# EAGLE design 16x32 Matrix (EAGLE 5.11)
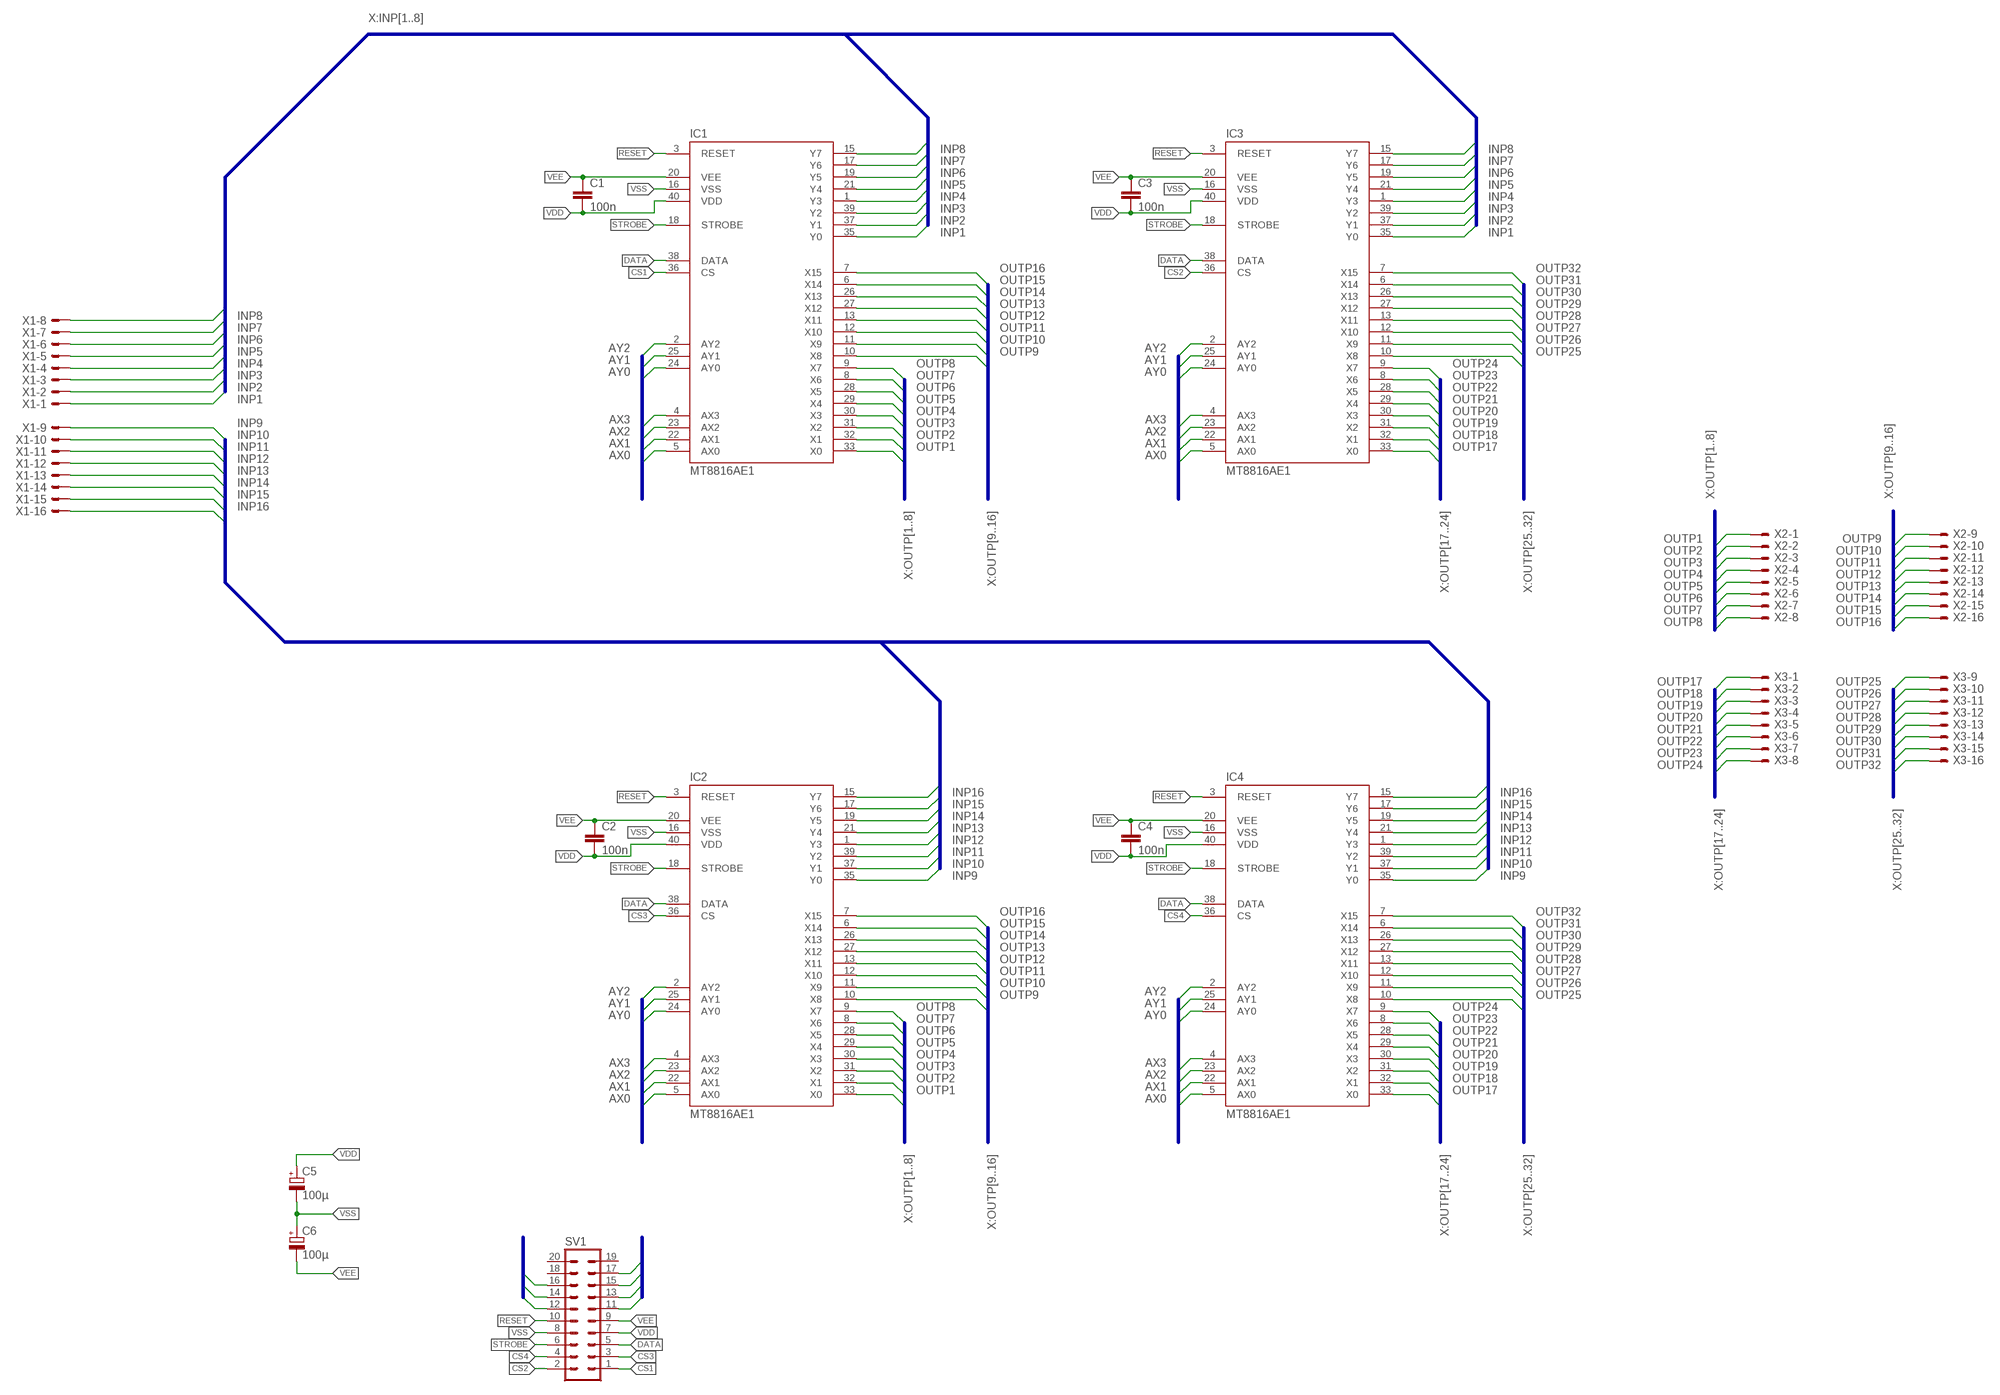
[diagram p0: schematic, sheet 1]

## Parts
C1  100n  C-EU050-035X075  [C050-035X075]
C2  100n  C-EU050-035X075  [C050-035X075]
C3  100n  C-EU050-035X075  [C050-035X075]
C4  100n  C-EU050-035X075  [C050-035X075]
C5  100µ  CPOL-EUE5-8.5  [E5-8,5]
C6  100µ  CPOL-EUE5-8.5  [E5-8,5]
IC1  MT8816AE1  [DIL40]
IC2  MT8816AE1  [DIL40]
IC3  MT8816AE1  [DIL40]
IC4  MT8816AE1  [DIL40]
SV1  ML203M  [3M_20]
X1  ML163ME  [3M_16]
X2  ML163ME  [3M_16]
X3  ML163ME  [3M_16]

## Nets
AX0: IC1.5(AX0) IC2.5(AX0) IC3.5(AX0) IC4.5(AX0) SV1.11
AX1: IC1.22(AX1) IC2.22(AX1) IC3.22(AX1) IC4.22(AX1) SV1.12
AX2: IC1.23(AX2) IC2.23(AX2) IC3.23(AX2) IC4.23(AX2) SV1.13
AX3: IC1.4(AX3) IC2.4(AX3) IC3.4(AX3) IC4.4(AX3) SV1.14
AY0: IC1.24(AY0) IC2.24(AY0) IC3.24(AY0) IC4.24(AY0) SV1.15
AY1: IC1.25(AY1) IC2.25(AY1) IC3.25(AY1) IC4.25(AY1) SV1.16
AY2: IC1.2(AY2) IC2.2(AY2) IC3.2(AY2) IC4.2(AY2) SV1.17
CS1: IC1.36(CS) SV1.1
CS2: IC3.36(CS) SV1.2
CS3: IC2.36(CS) SV1.3
CS4: IC4.36(CS) SV1.4
DATA: IC1.38(DATA) IC2.38(DATA) IC3.38(DATA) IC4.38(DATA) SV1.5
INP1: IC1.35(Y0) IC3.35(Y0) X1.1
INP2: IC1.37(Y1) IC3.37(Y1) X1.2
INP3: IC1.39(Y2) IC3.39(Y2) X1.3
INP4: IC1.1(Y3) IC3.1(Y3) X1.4
INP5: IC1.21(Y4) IC3.21(Y4) X1.5
INP6: IC1.19(Y5) IC3.19(Y5) X1.6
INP7: IC1.17(Y6) IC3.17(Y6) X1.7
INP8: IC1.15(Y7) IC3.15(Y7) X1.8
INP9: IC2.35(Y0) IC4.35(Y0) X1.9
INP10: IC2.37(Y1) IC4.37(Y1) X1.10
INP11: IC2.39(Y2) IC4.39(Y2) X1.11
INP12: IC2.1(Y3) IC4.1(Y3) X1.12
INP13: IC2.21(Y4) IC4.21(Y4) X1.13
INP14: IC2.19(Y5) IC4.19(Y5) X1.14
INP15: IC2.17(Y6) IC4.17(Y6) X1.15
INP16: IC2.15(Y7) IC4.15(Y7) X1.16
OUTP1: IC1.33(X0) IC2.33(X0) X2.1
OUTP2: IC1.32(X1) IC2.32(X1) X2.2
OUTP3: IC1.31(X2) IC2.31(X2) X2.3
OUTP4: IC1.30(X3) IC2.30(X3) X2.4
OUTP5: IC1.29(X4) IC2.29(X4) X2.5
OUTP6: IC1.28(X5) IC2.28(X5) X2.6
OUTP7: IC1.8(X6) IC2.8(X6) X2.7
OUTP8: IC1.9(X7) IC2.9(X7) X2.8
OUTP9: IC1.10(X8) IC2.10(X8) X2.9
OUTP10: IC1.11(X9) IC2.11(X9) X2.10
OUTP11: IC1.12(X10) IC2.12(X10) X2.11
OUTP12: IC1.13(X11) IC2.13(X11) X2.12
OUTP13: IC1.27(X12) IC2.27(X12) X2.13
OUTP14: IC1.26(X13) IC2.26(X13) X2.14
OUTP15: IC1.6(X14) IC2.6(X14) X2.15
OUTP16: IC1.7(X15) IC2.7(X15) X2.16
OUTP17: IC3.33(X0) IC4.33(X0) X3.1
OUTP18: IC3.32(X1) IC4.32(X1) X3.2
OUTP19: IC3.31(X2) IC4.31(X2) X3.3
OUTP20: IC3.30(X3) IC4.30(X3) X3.4
OUTP21: IC3.29(X4) IC4.29(X4) X3.5
OUTP22: IC3.28(X5) IC4.28(X5) X3.6
OUTP23: IC3.8(X6) IC4.8(X6) X3.7
OUTP24: IC3.9(X7) IC4.9(X7) X3.8
OUTP25: IC3.10(X8) IC4.10(X8) X3.9
OUTP26: IC3.11(X9) IC4.11(X9) X3.10
OUTP27: IC3.12(X10) IC4.12(X10) X3.11
OUTP28: IC3.13(X11) IC4.13(X11) X3.12
OUTP29: IC3.27(X12) IC4.27(X12) X3.13
OUTP30: IC3.26(X13) IC4.26(X13) X3.14
OUTP31: IC3.6(X14) IC4.6(X14) X3.15
OUTP32: IC3.7(X15) IC4.7(X15) X3.16
RESET: IC1.3(RESET) IC2.3(RESET) IC3.3(RESET) IC4.3(RESET) SV1.10
STROBE: IC1.18(STROBE) IC2.18(STROBE) IC3.18(STROBE) IC4.18(STROBE) SV1.6
VDD: C1.2 C2.2 C3.2 C4.2 C5.+ IC1.40(VDD) IC2.40(VDD) IC3.40(VDD) IC4.40(VDD) SV1.7
VEE: C1.1 C2.1 C3.1 C4.1 C6.- IC1.20(VEE) IC2.20(VEE) IC3.20(VEE) IC4.20(VEE) SV1.9
VSS: C5.- C6.+ IC1.16(VSS) IC2.16(VSS) IC3.16(VSS) IC4.16(VSS) SV1.8
Unconnected: SV1.18 SV1.19 SV1.20

## Buses
X:INP[1..8]
X:INP[9..16]
X:OUTP[1..8]
X:OUTP[25..32]
X:OUTP[9..16]
ADDRESS:AY[0..2],AX[0..3]
X:OUTP[17..24]

## Library data of the parts
C1-C4 = resistor:C-EU: CAPACITOR, European symbol
C5 C6 = resistor:CPOL-EU: POLARIZED CAPACITOR, European symbol
IC1-IC4 = MT8816:MT8816: 8x16 Analog Switch Array
SV1 = con-harting-ml:ML20: HARTING; OC_FARNELL: unknown; OC_NEWARK: unknown
X1-X3 = con-harting-ml:ML16?E: HARTING; OC_FARNELL: unknown; OC_NEWARK: unknown

## Board
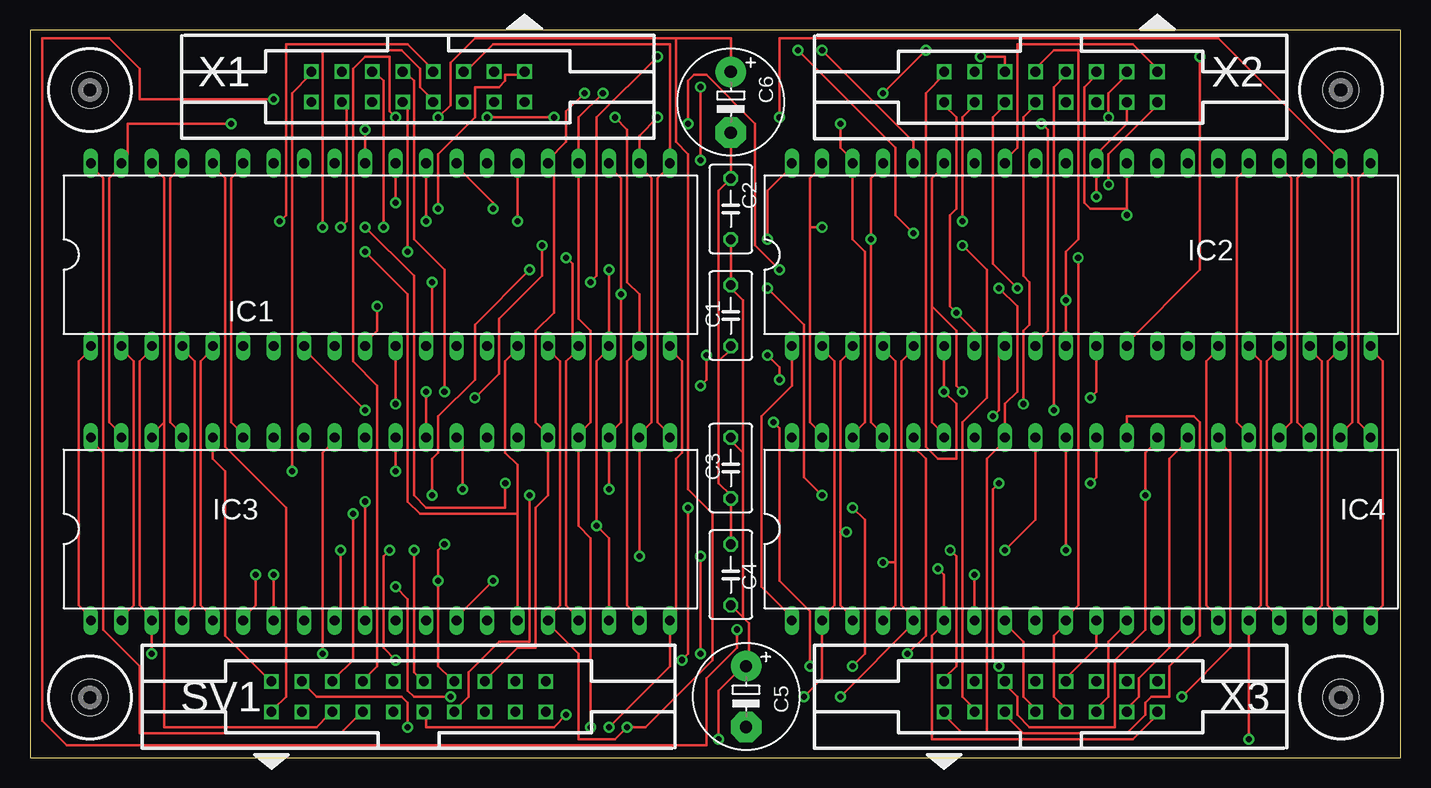
[diagram p1: board, top side]
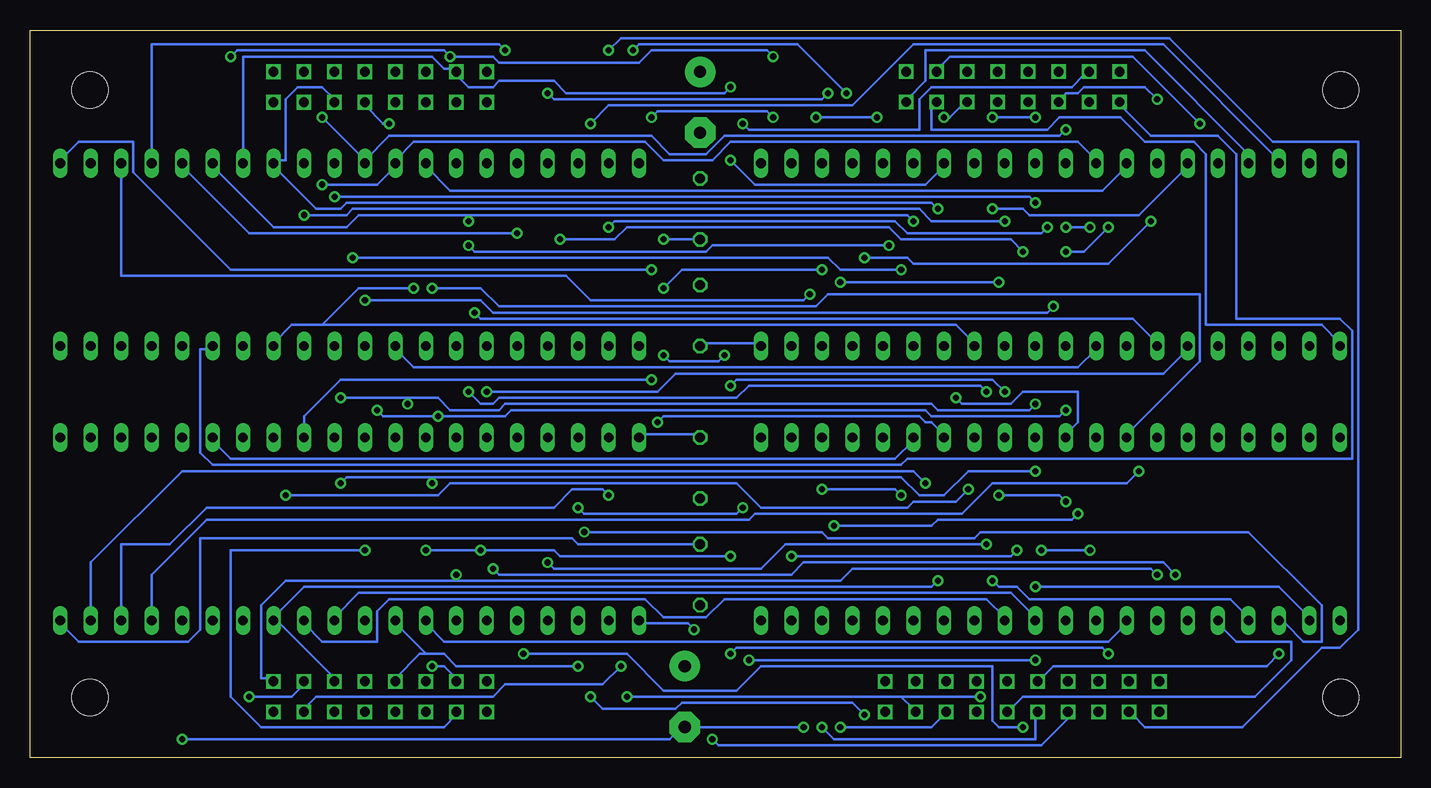
[diagram p2: board, bottom side, seen from below]

Size 114.28 x 60.63 mm. Coordinates in mm from the lower left corner, seen from the top.
Outline: 0,0 114.28,0 114.28,60.63 0,60.63 0,0
Copper layers (1*16): Top 0.035mm / dielectric 1.5mm / Bottom 0.035mm
Design rules "qp_designrules_8mil": minimum track width 8mil, minimum drill 20mil, track to track 8mil, track to pad 8mil, pad to pad 8mil, via to via 8mil, smd to smd 8mil, copper to edge 20mil, drill to drill 20mil, minimum pad ring 8mil, minimum via ring 8mil, stop-mask expansion 0mil, vias tented up to drill 0mil, thermal gap 10mil

### Footprints (pad centres in the part's own frame; a part is rotated, then mirrored left to right if it is on the bottom)
C050-035X075 = drill 0.813 octagon: 1 -2.54,0; 2 2.54,0
E5-8,5 = drill 1.016 pad 2.54 round: + -2.54,0 | drill 1.016 pad 2.54 octagon: - 2.54,0
DIL40 = drill 0.813 long: 1 -24.13,-7.62; 2 -21.59,-7.62; 3 -19.05,-7.62; 4 -16.51,-7.62; 5 -13.97,-7.62; 6 -11.43,-7.62; 7 -8.89,-7.62; 8 -6.35,-7.62; 9 -3.81,-7.62; 10 -1.27,-7.62; 11 1.27,-7.62; 12 3.81,-7.62; 13 6.35,-7.62; 14 8.89,-7.62; 15 11.43,-7.62; 16 13.97,-7.62; 17 16.51,-7.62; 18 19.05,-7.62; 19 21.59,-7.62; 20 24.13,-7.62; 21 24.13,7.62; 22 21.59,7.62; 23 19.05,7.62; 24 16.51,7.62; 25 13.97,7.62; 26 11.43,7.62; 27 8.89,7.62; 28 6.35,7.62; 29 3.81,7.62; 30 1.27,7.62; 31 -1.27,7.62; 32 -3.81,7.62; 33 -6.35,7.62; 34 -8.89,7.62; 35 -11.43,7.62; 36 -13.97,7.62; 37 -16.51,7.62; 38 -19.05,7.62; 39 -21.59,7.62; 40 -24.13,7.62
3M_20 = drill 0.813 square: 1 -11.43,-1.27; 2 -11.43,1.27; 3 -8.89,-1.27; 4 -8.89,1.27; 5 -6.35,-1.27; 6 -6.35,1.27; 7 -3.81,-1.27; 8 -3.81,1.27; 9 -1.27,-1.27; 10 -1.27,1.27; 11 1.27,-1.27; 12 1.27,1.27; 13 3.81,-1.27; 14 3.81,1.27; 15 6.35,-1.27; 16 6.35,1.27; 17 8.89,-1.27; 18 8.89,1.27; 19 11.43,-1.27; 20 11.43,1.27
DRIL-3 = hole 3: 0,0
3M_16 = drill 0.813 square: 1 -8.89,-1.27; 2 -8.89,1.27; 3 -6.35,-1.27; 4 -6.35,1.27; 5 -3.81,-1.27; 6 -3.81,1.27; 7 -1.27,-1.27; 8 -1.27,1.27; 9 1.27,-1.27; 10 1.27,1.27; 11 3.81,-1.27; 12 3.81,1.27; 13 6.35,-1.27; 14 6.35,1.27; 15 8.89,-1.27; 16 8.89,1.27

### Placement (x,y rotation side)
C1  58.42,36.83 90 top
C2  58.42,45.72 270 top
C3  58.42,24.13 90 top
C4  58.42,15.24 270 top
C5  59.69,5.08 270 top
C6  58.42,54.61 270 top
IC1  29.21,41.91 0 top
IC2  87.63,41.91 0 top
IC3  29.21,19.05 0 top
IC4  87.63,19.05 0 top
SV1  31.56,5.08 0 top
U$1  [DRIL-3]  5,5 0 top
U$2  [DRIL-3]  109.28,5 0 top
U$3  [DRIL-3]  5,55.63 0 top
U$4  [DRIL-3]  109.28,55.63 0 top
X1  32.34,55.89 180 top
X2  85.09,55.88 180 top
X3  85.09,5.08 0 top

### Tracks (layer width: path | path; a pad name or v marks a point on that pad's centre or on a via)
AX0  (via drill 0.51)
  Top 0.203: IC2.5 73.66,34.04 72.64,33.02 72.64,12.7 73.66,11.68 IC4.5 73.66,11.18 v67.56,5.08 | IC3.5 15.24,11.68 14.22,12.7 14.22,33.02 15.24,34.04 IC1.5 | v44.7,3.56 43.69,2.54 33.02,2.54 33.02,3.56 SV1.11
  Bottom 0.203: SV1.11 32.51,4.06 31.5,5.08 12.19,5.08 9.14,8.13 9.14,9.65 13.72,9.65 15.24,11.18 IC3.5 | v67.56,5.08 66.55,4.06 60.45,4.06 59.94,4.57 45.72,4.57 v44.7,3.56
AX1  (via drill 0.51)
  Top 0.203: IC4.22 109.22,26.92 110.24,27.94 110.24,48.26 109.22,49.28 IC2.22 109.22,49.78 99.06,59.94 62.48,59.94 v62.48,53.34 | v32,17.27 32,7.11 32.51,6.6 SV1.12 | v50.8,16.76 IC3.22 50.8,26.92 51.82,27.94 51.82,48.26 50.8,49.28 IC1.22 50.8,51.82 v52.32,53.34
  Bottom 0.203: v32,17.27 32.51,16.76 v50.8,16.76 | v62.48,53.34 61.98,53.85 52.83,53.85 v52.32,53.34
AX2  (via drill 0.51)
  Top 0.203: IC4.23 106.68,26.92 105.66,27.94 105.66,48.26 106.68,49.28 IC2.23 | v41.66,21.84 41.66,9.65 39.12,9.65 36.58,7.11 36.58,5.08 35.56,4.06 SV1.13 | v48.26,22.35 IC3.23 48.26,26.92 49.28,27.94 v49.28,38.61 49.28,48.26 48.26,49.28 IC1.23
  Bottom 0.203: v41.66,21.84 42.16,22.35 v48.26,22.35 | v49.28,38.61 49.78,38.1 67.56,38.1 69.6,40.13 106.68,40.13 IC2.23
AX3  (via drill 0.51)
  Top 0.203: 72.14,16.26 72.14,33.02 71.12,34.04 IC2.4 | 72.14,16.26 72.14,12.7 71.12,11.68 IC4.4 | IC3.4 12.7,11.68 13.72,12.7 13.72,33.02 12.7,34.04 IC1.4 | SV1.14 35.05,6.6 34.04,7.62 v34.04,14.73 34.04,17.27 v34.54,17.78 | v71.12,16.26 72.14,16.26
  Bottom 0.203: v34.04,14.73 33.53,14.22 32,14.22 30.99,13.21 14.22,13.21 12.7,11.68 IC3.4 | v71.12,16.26 70.61,15.75 53.34,15.75 51.31,17.78 v34.54,17.78
AY0  (via drill 0.51)
  Top 0.203: IC4.24 104.14,26.92 105.16,27.94 105.16,48.26 104.14,49.28 IC2.24 | v46.74,2.54 46.74,18.29 45.72,19.3 IC3.24 45.72,26.92 46.74,27.94 46.74,35.56 45.72,36.58 IC1.24 45.72,53.34 v47.75,55.37 | v71.12,55.37 v74.68,58.93
  Bottom 0.203: v46.74,2.54 39.12,2.54 38.1,3.56 SV1.15 | v74.68,58.93 75.18,59.44 104.14,59.44 IC2.24 | v71.12,55.37 70.61,54.86 48.26,54.86 v47.75,55.37
AY1  (via drill 0.51)
  Top 0.203: IC4.25 101.6,26.92 100.58,27.94 100.58,48.26 101.6,49.28 IC2.25 | SV1.16 38.1,6.6 40.64,9.14 42.16,9.14 42.16,20.83 43.18,21.84 IC3.25 43.18,26.92 42.16,27.94 42.16,35.56 43.69,37.08 43.69,48.77 43.18,49.28 IC1.25 43.18,49.78 44.7,51.31 44.7,53.85 v46.23,55.37 | v73.66,43.69 72.14,45.21 72.14,50.8 v64.01,58.93
  Bottom 0.203: v73.66,43.69 96.01,43.69 101.6,49.28 IC2.25 | v64.01,58.93 63.5,59.44 50.29,59.44 v46.23,55.37
AY2  (via drill 0.51)
  Top 0.203: IC3.2 7.62,11.68 8.64,12.7 8.64,33.02 7.62,34.04 IC1.2 | v64.52,5.08 66.04,6.6 IC4.2 66.04,11.68 67.06,12.7 67.06,33.02 66.04,34.04 IC2.2 | v30.48,14.22 31.5,13.21 31.5,5.59 32,5.08 v35.05,5.08
  Bottom 0.203: 41.66,5.08 40.64,4.06 SV1.17 | 41.66,5.08 v64.52,5.08 | v30.48,14.22 10.16,14.22 7.62,11.68 IC3.2 | v35.05,5.08 41.66,5.08
CS1
  Top 0.203: SV1.1 20.32,4.06 21.34,5.08 21.34,20.83 16.26,25.91 16.26,48.26 15.24,49.28 IC1.36
CS2
  Top 0.203: SV1.2 19.81,6.6 16.26,10.16 16.26,23.88 15.24,24.89 IC3.36
CS3  (via drill 0.51)
  Top 0.203: v66.04,58.93 73.66,51.31 IC2.36
  Bottom 0.203: v66.04,58.93 65.02,59.94 19.3,59.94 10.67,51.31 3.56,51.31 3.56,10.67 5.08,9.14 6.6,9.14 13.21,2.54 21.34,2.54 22.35,3.56 SV1.3
CS4  (via drill 0.51)
  Top 0.203: v31.5,2.54 31.5,4.57 30.99,5.08 23.88,5.08 22.86,6.1 SV1.4 | v73.15,8.64 74.68,10.16 74.68,24.89 73.66,25.91 IC4.36
  Bottom 0.203: v31.5,2.54 33.53,2.54 34.04,3.05 34.04,7.62 53.34,7.62 55.37,5.59 61.47,5.59 64.52,8.64 v73.15,8.64
DATA  (via drill 0.51)
  Top 0.203: IC4.38 68.58,26.92 69.6,27.94 69.6,42.16 68.58,43.18 IC2.38 68.58,49.78 67.56,50.8 v67.56,52.83 | 11.18,27.94 10.16,26.92 IC3.38 | 11.18,27.94 11.18,48.26 10.16,49.28 IC1.38 | 11.18,27.94 11.18,2.54 23.88,2.54 24.89,3.56 SV1.5
  Bottom 0.203: v67.56,52.83 66.04,54.36 45.72,54.36 40.64,59.44 19.81,59.44 10.16,49.78 IC1.38
INP1  (via drill 0.51)
  Top 0.203: IC3.35 17.78,26.92 16.76,27.94 16.76,48.26 17.78,49.28 IC1.35 | v34.04,45.72 34.04,50.29 37.08,53.34 37.08,55.88 39.12,55.88 39.62,56.39 39.62,56.9 41.15,56.9 X1.1
  Bottom 0.203: v34.04,45.72 31.5,45.72 30.99,45.21 21.84,45.21 17.78,49.28 IC1.35
INP2
  Top 0.203: IC3.37 12.7,26.92 11.68,27.94 11.68,48.26 12.7,49.28 IC1.37
  Bottom 0.203: X1.2 41.15,54.86 39.62,56.39 39.62,58.93 21.34,58.93 12.7,50.29 IC1.37
INP3  (via drill 0.51)
  Top 0.203: IC3.39 7.62,26.92 6.6,27.94 6.6,48.26 7.62,49.28 IC1.39 7.62,49.78 8.13,50.29 8.13,52.83 v16.76,52.83
  Bottom 0.203: v16.76,52.83 22.35,58.42 37.59,58.42 38.61,57.4 X1.3
INP4
  Top 0.203: IC3.1 5.08,11.68 4.06,12.7 4.06,33.02 5.08,34.04 IC1.1
  Bottom 0.203: X1.4 39.12,54.36 39.12,52.32 29.46,52.32 28.45,53.34 23.37,53.34 21.34,51.31 17.27,51.31 16.26,50.29 16.26,36.07 6.6,36.07 5.08,34.54 IC1.1
INP5
  Top 0.203: IC3.21 53.34,26.92 52.32,27.94 52.32,48.26 53.34,49.28 IC1.21 53.34,59.44 38.61,59.44 36.58,57.4 X1.5
INP6  (via drill 0.51)
  Top 0.203: IC3.19 50.8,11.68 49.78,12.7 49.78,33.02 50.8,34.04 IC1.19 50.8,38.61 49.78,39.62 49.78,52.32 v48.77,53.34 | v43.69,53.34 v38.1,53.34
  Bottom 0.203: v38.1,53.34 37.59,53.34 36.58,54.36 X1.6 | v48.77,53.34 v43.69,53.34
INP7  (via drill 0.51)
  Top 0.203: 45.21,33.53 45.72,34.04 IC1.17 45.21,33.53 | 45.21,33.53 44.7,33.02 44.7,12.7 45.72,11.68 IC3.17 | v20.83,44.7 21.34,45.21 21.34,59.44 31.5,59.44 33.53,57.4 X1.7 | v44.7,41.66 45.21,41.15 45.21,33.53
  Bottom 0.203: v20.83,44.7 24.38,41.15 40.64,41.15 41.15,41.66 v44.7,41.66
INP8  (via drill 0.51)
  Top 0.203: 40.64,20.32 40.64,24.38 39.62,25.4 39.62,33.02 40.64,34.04 IC1.15 | IC3.15 40.64,20.32 | v24.38,44.2 24.38,58.93 30.99,58.93 32.51,57.4 32.51,55.88 33.53,54.86 X1.8 | v27.94,42.16 31.5,38.61 31.5,21.34 32.51,20.32 40.64,20.32
  Bottom 0.203: v24.38,44.2 26.42,42.16 v27.94,42.16
INP9  (via drill 0.51)
  Top 0.203: 75.18,37.59 75.18,48.26 76.2,49.28 IC2.35 | 75.18,37.59 75.18,27.94 76.2,26.92 IC4.35 | v34.54,30.48 34.54,40.64 32,43.18 32,56.39 31.5,56.9 X1.9 | v77.72,30.48 77.22,30.99 77.22,35.56 75.18,37.59
  Bottom 0.203: v34.54,30.48 35.05,30.99 54.36,30.99 55.37,29.97 75.18,29.97 75.69,29.46 76.71,29.46 v77.72,30.48
INP10  (via drill 0.51)
  Top 0.203: IC4.37 71.12,26.92 70.1,27.94 v70.1,43.18 70.1,48.26 71.12,49.28 IC2.37 | v31.5,42.16 31.5,54.36 X1.10
  Bottom 0.203: v31.5,42.16 32.51,43.18 41.66,43.18 42.67,44.2 64.52,44.2 65.53,43.18 v70.1,43.18
INP11  (via drill 0.51)
  Top 0.203: 65.02,44.2 65.02,48.26 66.04,49.28 IC2.39 | 65.02,44.2 65.02,27.94 66.04,26.92 IC4.39 | v29.46,44.2 29.46,56.39 28.96,56.9 X1.11 | v66.04,44.2 65.02,44.2
  Bottom 0.203: v29.46,44.2 29.97,43.69 41.15,43.69 42.16,44.7 65.53,44.7 v66.04,44.2
INP12  (via drill 0.51)
  Top 0.203: IC4.1 63.5,11.68 60.96,14.22 60.96,28.45 63.5,30.99 IC2.1 | v20.32,54.86 9.14,54.86 9.14,57.4 6.6,59.94 1.02,59.94 1.02,3.05 3.05,1.02 56.39,1.02 56.39,6.6 58.93,9.14 v58.93,10.67
  Bottom 0.203: v20.32,54.86 21.34,55.88 26.42,55.88 26.92,55.37 27.94,55.37 28.45,54.86 X1.12 | v58.93,10.67 59.44,11.18 63.5,11.18 IC4.1
INP13  (via drill 0.51)
  Top 0.203: IC4.21 111.76,26.92 110.74,27.94 110.74,48.26 111.76,49.28 IC2.21 | v54.86,52.83 54.86,56.39 55.37,56.9 56.39,56.9 60.45,52.83 60.45,42.67 v62.48,40.64
  Bottom 0.203: v54.86,52.83 54.36,52.32 40.13,52.32 40.13,54.86 39.12,55.88 27.43,55.88 26.42,56.9 X1.13 | v62.48,40.64 97.54,40.64 105.66,48.77 105.66,51.31 110.24,51.31 111.76,49.78 IC2.21
INP14  (via drill 0.51)
  Top 0.203: IC4.19 109.22,11.68 108.2,12.7 108.2,33.02 109.22,34.04 IC2.19 | v25.91,44.2 26.42,44.7 26.42,54.36 X1.14 | v27.94,44.2 32,40.13 32,21.84 33.02,20.83 39.62,20.83 v39.62,22.86
  Bottom 0.203: v27.94,44.2 v25.91,44.2 | v39.62,22.86 40.64,23.88 101.6,23.88 109.22,16.26 IC4.19
INP15  (via drill 0.51)
  Top 0.203: IC4.17 104.14,11.68 103.12,12.7 103.12,33.02 104.14,34.04 IC2.17 | v21.84,23.88 21.84,55.37 23.37,56.9 X1.15
  Bottom 0.203: v21.84,23.88 22.86,22.86 34.04,22.86 36.58,20.32 53.85,20.32 54.36,19.81 99.57,19.81 104.14,15.24 IC4.17
INP16
  Top 0.203: IC4.15 99.06,11.68 98.04,12.7 98.04,33.02 99.06,34.04 IC2.15
  Bottom 0.203: X1.16 23.37,54.36 20.83,51.82 15.24,51.82 13.72,50.29 13.72,36.58 5.08,36.58 4.06,35.56 4.06,24.89 41.15,24.89 41.66,24.38 99.06,24.38 100.08,25.4 100.08,34.04 99.06,34.04 IC2.15
OUTP1
  Top 0.203: X2.1 93.98,57.4 91.95,59.44 82.3,59.44 82.3,50.8 81.28,49.78 IC2.33
  Bottom 0.203: IC1.33 22.86,49.28 24.89,47.24 79.25,47.24 81.28,49.28 IC2.33
OUTP2  (via drill 0.51)
  Top 0.203: v89.92,47.75 89.92,50.29 93.98,54.36 X2.2
  Bottom 0.203: IC1.32 25.4,49.78 26.92,51.31 55.88,51.31 57.4,49.78 61.47,49.78 62.99,51.31 82.3,51.31 83.82,49.78 IC2.32 83.82,49.28 85.34,47.75 v89.92,47.75
OUTP3  (via drill 0.51)
  Top 0.203: IC1.31 v27.94,52.32 | v89.92,53.34 89.92,55.37 91.44,56.9 X2.3
  Bottom 0.203: v27.94,52.32 28.45,51.82 56.39,51.82 57.91,50.29 60.96,50.29 62.48,51.82 84.33,51.82 86.36,49.78 | 86.36,49.78 v89.92,53.34 | 86.36,49.78 IC2.31
OUTP4  (via drill 0.51)
  Top 0.203: v30.48,46.23 IC1.30 | v88.9,46.74 IC2.30 88.9,50.29 91.44,52.83 X2.4
  Bottom 0.203: v30.48,46.23 30.99,46.74 v88.9,46.74
OUTP5  (via drill 0.51)
  Top 0.203: v91.44,45.21 91.44,45.72 | v33.02,44.7 IC1.29 | 91.44,45.72 IC2.29 | 91.44,45.72 88.39,45.72 87.88,46.23 87.88,55.88 88.9,56.9 X2.5
  Bottom 0.203: v33.02,44.7 39.12,44.7 40.13,45.72 87.38,45.72 87.88,45.21 v91.44,45.21
OUTP6  (via drill 0.51)
  Top 0.203: v38.61,45.72 38.61,46.23 35.56,49.28 IC1.28
  Bottom 0.203: v38.61,45.72 39.12,46.23 87.88,46.23 88.39,45.72 90.42,45.72 93.98,49.28 IC2.28 93.98,49.78 92.96,49.78 92.96,54.86 91.95,55.88 89.92,55.88 88.9,54.86 X2.6
OUTP7  (via drill 0.51)
  Top 0.203: v27.94,28.96 22.86,34.04 IC1.8 | v80.26,28.45 80.77,28.96 80.77,33.53 81.28,34.04 IC2.8 | v85.34,28.96 85.34,55.88 86.36,56.9 X2.7
  Bottom 0.203: v27.94,28.96 28.45,28.45 39.12,28.45 39.62,28.96 74.17,28.96 74.68,28.45 v80.26,28.45 84.84,28.45 v85.34,28.96
OUTP8  (via drill 0.51)
  Top 0.203: v84.33,52.83 84.84,52.32 84.84,35.56 83.82,34.54 IC2.9
  Bottom 0.203: IC1.9 25.4,34.04 26.92,32.51 82.3,32.51 83.82,34.04 IC2.9 | v84.33,52.83 84.84,52.83 86.36,54.36 X2.8
OUTP9  (via drill 0.51)
  Top 0.203: v28.96,37.59 28.96,35.56 27.94,34.54 IC1.10 | IC2.10 v86.36,38.1 86.36,42.16 87.38,43.18 87.38,58.93 85.34,58.93 83.82,57.4 X2.9
  Bottom 0.203: v28.96,37.59 29.46,37.08 75.69,37.08 76.71,38.1 v86.36,38.1
OUTP10  (via drill 0.51)
  Top 0.203: v88.39,29.97 88.9,30.48 IC2.11 | v30.48,29.46 IC1.11 | v82.8,29.46 82.8,35.56 83.31,36.07 83.31,39.62 82.8,40.13 82.8,53.34 83.82,54.36 X2.10
  Bottom 0.203: v30.48,29.46 30.99,28.96 38.61,28.96 39.12,29.46 74.68,29.46 75.18,28.96 79.25,28.96 80.26,29.97 82.8,29.97 | 82.8,29.97 v88.39,29.97 | 82.8,29.97 v82.8,29.46
OUTP11  (via drill 0.51)
  Top 0.203: v33.53,39.62 33.53,35.05 33.02,34.54 IC1.12 | v46.74,39.62 47.24,40.13 47.24,53.34 v52.32,58.42 | v79.25,58.42 81.28,58.42 X2.11 | v97.54,58.42 97.54,40.64 91.44,34.54 IC2.12
  Bottom 0.203: v33.53,39.62 v46.74,39.62 | v52.32,58.42 52.83,58.93 62.48,58.93 63.5,57.91 75.18,57.91 75.69,58.42 v79.25,58.42 79.76,58.93 97.03,58.93 v97.54,58.42
OUTP12  (via drill 0.51)
  Top 0.203: v82.3,39.12 80.26,41.15 80.26,53.34 81.28,54.36 X2.12
  Bottom 0.203: 89.92,36.07 92.46,36.07 93.98,34.54 IC2.13 | 89.92,36.07 37.08,36.07 35.56,34.54 IC1.13 | v82.3,39.12 86.87,39.12 89.92,36.07
OUTP13  (via drill 0.51)
  Top 0.203: v55.88,49.78 v55.88,55.88
  Bottom 0.203: v55.88,49.78 53.85,47.75 39.62,47.75 38.1,49.28 IC1.27 | v55.88,55.88 56.39,55.37 69.6,55.37 70.61,56.39 75.18,56.39 75.69,55.88 77.72,55.88 78.74,56.9 X2.13 78.74,57.4 79.76,57.4 80.77,58.42 96.52,58.42 IC2.27
OUTP14  (via drill 0.51)
  Top 0.203: v40.64,44.7 IC1.26 | v77.72,44.7 77.72,53.34 78.74,54.36 X2.14
  Bottom 0.203: v40.64,44.7 41.15,45.21 77.72,45.21 | 77.72,45.21 86.87,45.21 87.88,44.2 93.98,44.2 99.06,49.28 IC2.26 | 77.72,45.21 v77.72,44.7
OUTP15  (via drill 0.51)
  Top 0.203: IC2.6 v76.2,30.48 77.22,29.46 77.22,24.89 75.69,24.89 74.68,25.91 74.68,55.37 76.2,56.9 X2.15
  Bottom 0.203: v76.2,30.48 61.98,30.48 60.45,32 19.81,32 17.78,34.04 IC1.6
OUTP16  (via drill 0.51)
  Top 0.203: IC2.7 78.74,35.56 v77.22,37.08 76.71,37.59 76.71,45.21 77.22,45.72 77.22,53.34 76.2,54.36 X2.16
  Bottom 0.203: v77.22,37.08 76.71,36.58 22.35,36.58 20.32,34.54 IC1.7
OUTP17  (via drill 0.51)
  Top 0.203: v80.77,39.12 82.3,37.59 82.3,30.48 81.28,29.46 IC4.33 81.28,26.42 79.76,24.89 79.76,2.03 77.72,2.03 76.2,3.56 X3.1
  Bottom 0.203: v80.77,39.12 76.71,39.12 75.18,37.59 48.77,37.59 47.75,38.61 16.76,38.61 16.76,33.02 22.86,26.92 IC3.33
OUTP18  (via drill 0.51)
  Top 0.203: v24.38,8.64 24.38,25.4 25.4,26.42 IC3.32 | v55.88,8.64 v55.88,16.76 | v81.28,17.27 83.82,19.81 IC4.32 | v76.71,17.27 77.22,16.76 77.22,7.62 76.2,6.6 X3.2
  Bottom 0.203: v24.38,8.64 24.89,9.14 55.37,9.14 v55.88,8.64 | v55.88,16.76 70.1,16.76 70.61,17.27 v76.71,17.27 v81.28,17.27
OUTP19  (via drill 0.51)
  Top 0.203: v86.36,17.27 IC4.31 | v37.08,29.97 39.12,32 39.12,36.58 42.67,40.13 v42.67,42.67 | v77.72,42.67 79.76,40.64 79.76,29.97 77.72,27.94 77.72,5.08 78.74,4.06 X3.3
  Bottom 0.203: v86.36,17.27 97.54,17.27 97.54,5.08 95,2.54 79.76,2.54 78.74,3.56 X3.3 | v37.08,29.97 36.58,29.46 32.51,29.46 31.5,30.48 26.92,30.48 26.92,27.94 27.94,26.92 IC3.31 | v42.67,42.67 57.4,42.67 57.91,42.16 77.22,42.16 v77.72,42.67
OUTP20  (via drill 0.51)
  Top 0.203: v88.39,22.86 88.9,23.37 IC4.30 | v30.48,23.88 IC3.30 | v80.77,7.62 80.26,8.13 80.26,22.35 v80.77,22.86
  Bottom 0.203: v30.48,23.88 36.07,23.88 38.1,21.84 40.13,21.84 41.66,23.37 80.77,23.37 | 80.77,23.37 87.88,23.37 v88.39,22.86 | v80.77,7.62 79.76,7.62 78.74,6.6 X3.4 | 80.77,23.37 v80.77,22.86
OUTP21  (via drill 0.51)
  Top 0.203: v55.88,30.99 56.39,31.5 v56.39,33.53 | v61.47,33.53 62.48,32.51 v62.48,31.5 | IC3.29 v33.02,30.48 | X3.5 81.28,3.56 82.8,2.03 91.44,2.03 92.96,3.56 92.96,4.57 93.47,5.08 95,5.08 95,7.62 97.54,10.16 97.54,27.94 97.03,28.45 91.44,28.45 IC4.29
  Bottom 0.203: v33.02,30.48 34.04,31.5 55.37,31.5 v55.88,30.99 | v56.39,33.53 56.9,33.02 60.96,33.02 v61.47,33.53 | v62.48,31.5 88.39,31.5 91.44,28.45 IC4.29
OUTP22  (via drill 0.51)
  Top 0.203: X3.6 81.28,6.1 82.3,5.08 82.3,3.56 83.31,2.54 90.42,2.54 90.42,8.13 92.96,10.67 v92.96,21.84 92.96,25.4 93.98,26.42 IC4.28 | v36.07,22.35 36.07,25.91 35.56,26.42 IC3.28
  Bottom 0.203: v36.07,22.35 37.08,21.34 40.64,21.34 41.15,20.83 53.34,20.83 55.37,22.86 79.25,22.86 80.26,21.84 v92.96,21.84
OUTP23
  Top 0.203: X3.7 83.82,4.06 82.8,5.08 82.8,9.65 81.28,11.18 IC4.8
  Bottom 0.203: IC3.8 22.86,11.18 24.38,9.65 79.76,9.65 81.28,11.18 IC4.8
OUTP24  (via drill 0.51)
  Top 0.203: v25.91,17.27 25.91,12.19 25.4,11.68 IC3.9 | v29.97,17.27 29.46,16.76 29.46,9.14 v30.48,8.13 | v54.36,8.13 54.86,8.64 v54.86,20.83 | v68.58,20.83 69.6,19.81 69.6,8.64 v68.58,7.62
  Bottom 0.203: v25.91,17.27 v29.97,17.27 | v30.48,8.13 v54.36,8.13 | v54.86,20.83 55.37,20.32 68.07,20.32 v68.58,20.83 | v68.58,7.62 78.74,7.62 79.76,8.64 81.28,8.64 | 81.28,8.64 81.79,8.64 83.82,6.6 X3.8 | 81.28,8.64 83.82,11.18 IC4.9
OUTP25  (via drill 0.51)
  Top 0.203: X3.9 86.36,4.06 85.34,5.08 85.34,10.16 86.36,11.18 IC4.10 86.36,11.68 87.38,12.7 v87.38,41.66 | v33.53,21.84 33.53,24.89 34.04,25.4 34.04,28.45 37.08,31.5 37.08,36.07 v41.66,40.64 | IC3.10 v27.94,21.34
  Bottom 0.203: v27.94,21.34 28.45,21.84 v33.53,21.84 | v41.66,40.64 46.74,40.64 47.75,41.66 v87.38,41.66
OUTP26
  Top 0.203: X3.10 86.36,6.6 88.9,9.14 IC4.11
  Bottom 0.203: IC3.11 30.48,11.68 32.51,13.72 86.87,13.72 88.9,11.68 IC4.11
OUTP27
  Top 0.203: X3.11 88.9,4.06 89.92,5.08 89.92,9.65 91.44,11.18 IC4.12
  Bottom 0.203: IC3.12 33.02,11.68 34.54,13.21 56.39,13.21 57.91,11.68 61.47,11.68 62.99,13.21 84.33,13.21 85.34,12.19 85.34,9.65 89.92,9.65 91.44,11.18 IC4.12
OUTP28  (via drill 0.51)
  Top 0.203: v38.61,14.73 35.56,11.68 IC3.13
  Bottom 0.203: v38.61,14.73 39.12,14.22 91.44,14.22 93.98,11.68 IC4.13 93.98,11.18 93.47,11.18 88.9,6.6 X3.12
OUTP29  (via drill 0.51)
  Top 0.203: v61.98,27.94 62.48,27.43 62.48,14.73 65.02,12.19 v65.02,7.62 | IC4.27 96.52,26.42 95,24.89 95,9.14 92.46,6.6 92.46,5.08 91.44,4.06 X3.13
  Bottom 0.203: v61.98,27.94 61.47,28.45 40.13,28.45 39.62,27.94 39.12,27.94 38.1,26.92 IC3.27 | v65.02,7.62 66.55,6.1 74.68,6.1 75.69,5.08 90.42,5.08 91.44,4.06 X3.13
OUTP30  (via drill 0.51)
  Top 0.203: v96.01,5.08 100.08,9.14 100.08,25.4 99.06,26.42 IC4.26
  Bottom 0.203: IC3.26 40.64,26.42 42.16,24.89 97.54,24.89 99.06,26.42 IC4.26 | v96.01,5.08 92.46,5.08 91.44,6.1 X3.14
OUTP31  (via drill 0.51)
  Top 0.203: v18.8,15.24 18.8,12.7 17.78,11.68 IC3.6 | v75.69,15.75 76.2,15.24 IC4.6 76.2,11.18 75.18,10.16 75.18,1.52 91.95,1.52 93.98,3.56 X3.15
  Bottom 0.203: v18.8,15.24 19.81,16.26 49.78,16.26 50.8,15.24 75.18,15.24 v75.69,15.75
OUTP32  (via drill 0.51)
  Top 0.203: IC3.7 v20.32,15.24 | v78.74,15.24 IC4.7
  Bottom 0.203: v20.32,15.24 20.83,15.75 45.72,15.75 46.74,14.73 78.74,14.73 | 78.74,14.73 92.96,14.73 95,12.7 95,6.6 93.98,6.6 X3.16 | 78.74,14.73 v78.74,15.24
RESET  (via drill 0.51)
  Top 0.203: 67.56,18.8 67.56,33.02 68.58,34.04 IC2.3 | 67.56,18.8 67.56,12.7 68.58,11.68 IC4.3 | IC1.3 10.16,34.04 9.14,33.02 9.14,12.7 10.16,11.68 IC3.3 v10.16,8.64 | v68.07,18.8 67.56,18.8
  Bottom 0.203: v10.16,8.64 11.18,7.62 28.96,7.62 29.97,6.6 SV1.10 | v68.07,18.8 48.26,18.8 47.75,18.29 35.56,18.29 35.05,18.8 12.7,18.8 6.6,12.7 6.6,9.65 8.13,9.65 9.65,11.18 10.16,11.18 IC3.3
STROBE  (via drill 0.51)
  Top 0.203: IC4.18 106.68,11.68 107.7,12.7 107.7,33.02 106.68,34.04 IC2.18 | v26.92,20.32 26.92,8.13 25.4,6.6 SV1.6 | IC3.18 48.26,18.29 v47.24,19.3 47.24,33.02 48.26,34.04 IC1.18 v48.26,40.64 | v66.04,21.84 64.52,23.37 64.52,36.07 v61.47,39.12
  Bottom 0.203: v26.92,20.32 27.43,19.81 38.61,19.81 39.12,19.3 v47.24,19.3 | v66.04,21.84 66.55,22.35 69.09,22.35 70.61,20.83 99.57,20.83 102.62,17.78 106.68,17.78 IC4.18 | v61.47,39.12 59.94,40.64 v48.26,40.64
VDD  (via drill 0.51)
  Top 0.203: C2.2 C1.2 58.42,39.12 59.44,38.1 59.44,25.4 | v61.47,43.18 61.47,47.24 63.5,49.28 IC2.40 | 59.44,11.68 59.94,11.18 59.94,7.62 C5.+ 59.44,7.62 57.4,5.59 v57.4,1.52 | 59.44,11.68 C4.2 | 59.44,25.4 58.42,26.42 C3.2 | 59.44,11.68 59.44,25.4 | 6.1,25.4 6.1,10.67 9.14,7.62 9.14,2.03 25.91,2.03 27.43,3.56 SV1.7 | 6.1,25.4 5.08,26.42 IC3.40 | 6.1,25.4 6.1,48.26 5.08,49.28 IC1.40
  Bottom 0.203: C2.2 v61.47,43.18 | C3.2 58.42,26.92 63.5,26.92 IC4.40 | v57.4,1.52 56.9,1.02 29.97,1.02 27.43,3.56 SV1.7
VEE  (via drill 0.51)
  Top 0.203: v48.26,2.54 53.34,7.62 IC3.20 53.34,11.68 53.85,12.19 53.85,24.89 54.36,25.4 54.36,33.02 53.34,34.04 IC1.20 | IC4.20 111.76,11.68 112.78,12.7 112.78,33.02 111.76,34.04 IC2.20 | C6.- C2.1 57.4,47.24 57.4,33.02 | C4.1 C3.1 58.42,21.84 57.4,22.86 57.4,33.02 | 57.4,33.02 58.42,34.04 C1.1
  Bottom 0.203: v48.26,2.54 47.24,1.52 30.48,1.52 30.48,3.56 SV1.9 | IC1.20 53.34,34.54 58.42,34.54 C1.1 | C4.1 68.58,17.78 69.09,18.29 100.08,18.29 100.08,10.67 101.09,9.65 110.24,9.65 111.76,11.18 IC4.20
VSS  (via drill 0.51)
  Top 0.203: v30.48,53.34 29.97,53.85 29.97,58.42 27.94,58.42 26.92,57.4 26.92,33.02 28.96,30.99 28.96,7.62 27.94,6.6 SV1.8 | v34.04,53.34 35.05,54.36 35.05,57.91 37.08,59.94 53.85,59.94 | 53.85,59.94 58.42,59.94 C6.+ | IC2.16 101.6,34.04 102.62,33.02 102.62,12.7 101.6,11.68 IC4.16 v101.6,1.52 | IC1.16 43.18,34.04 44.2,33.02 44.2,12.7 43.18,11.68 IC3.16 43.18,11.18 45.72,8.64 45.72,1.52 48.77,1.52 v49.78,2.54 51.31,2.54 56.9,8.13 56.9,20.32 54.86,22.35 54.86,50.29 53.85,51.31 53.85,59.94
  Bottom 0.203: v30.48,53.34 v34.04,53.34 | v49.78,2.54 C5.- 59.94,2.54 60.96,1.52 v101.6,1.52